# EAGLE board battery_module (EAGLE 9.1.1), part 1 of 2
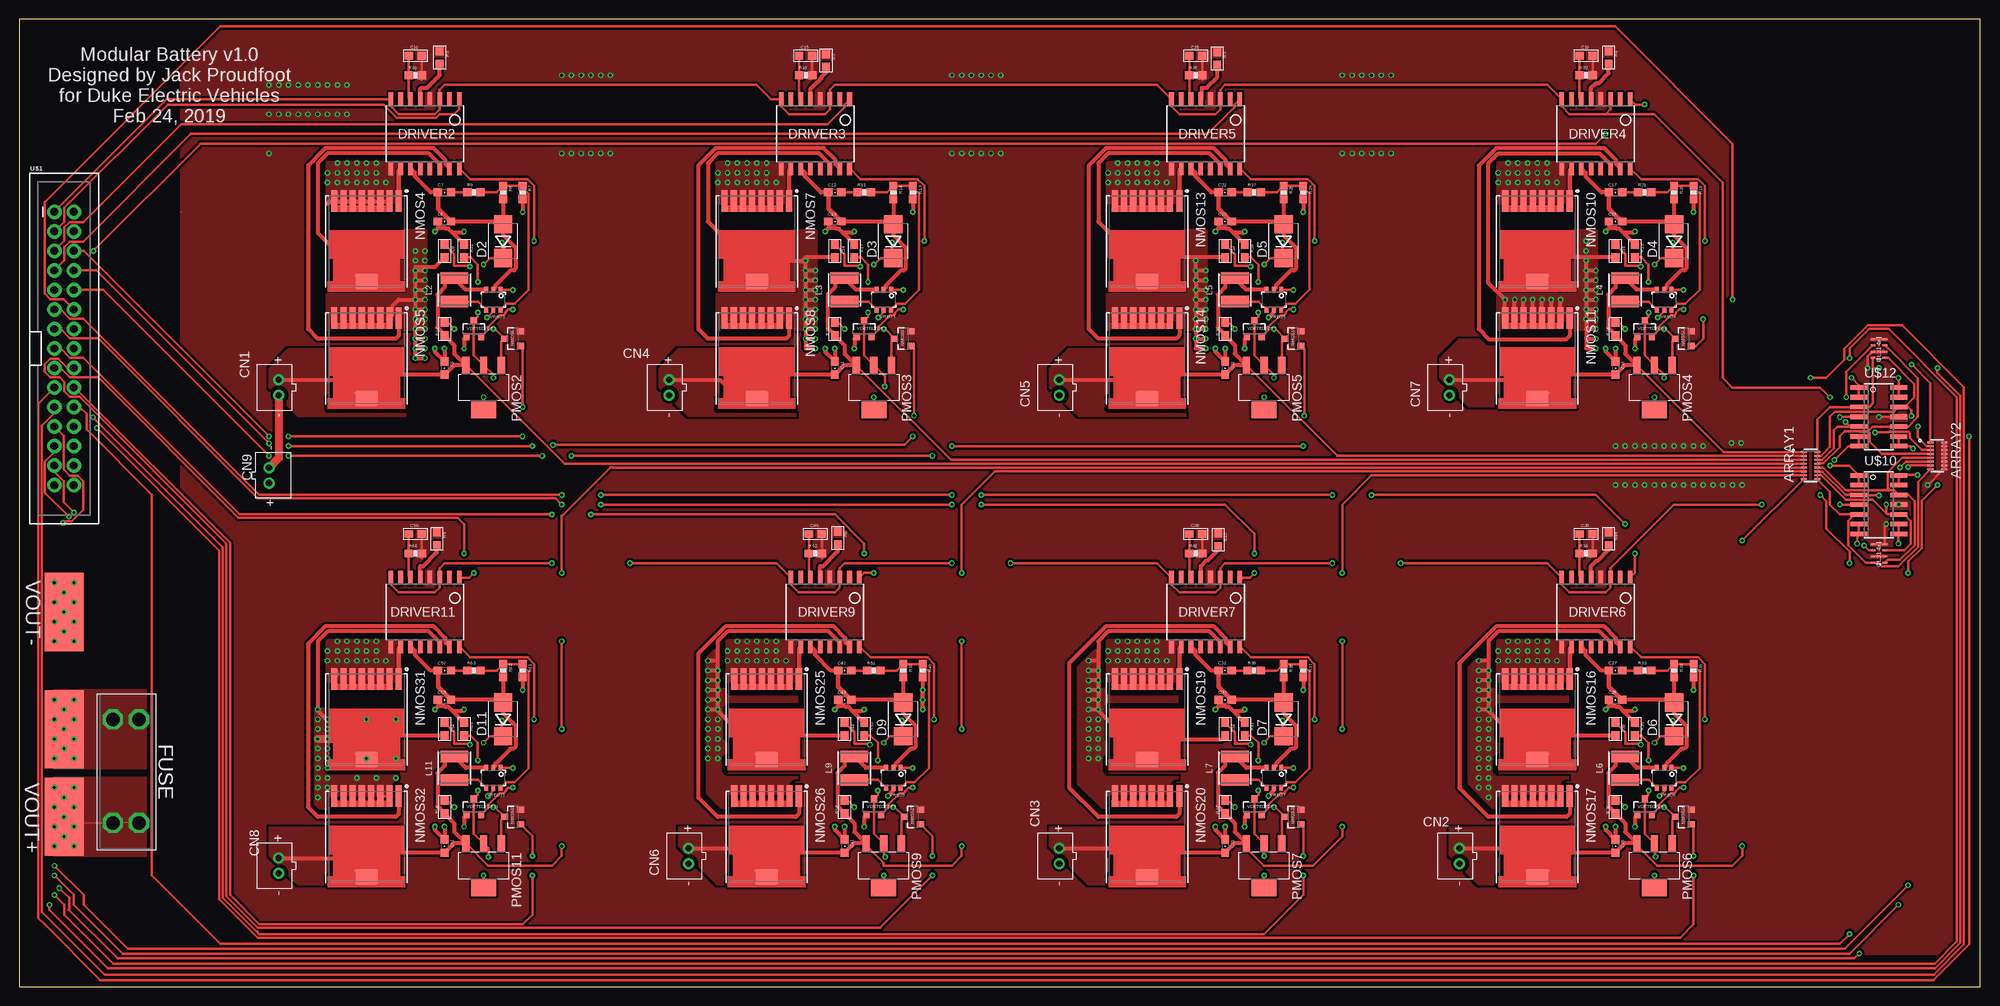
[diagram p2: board, top side]
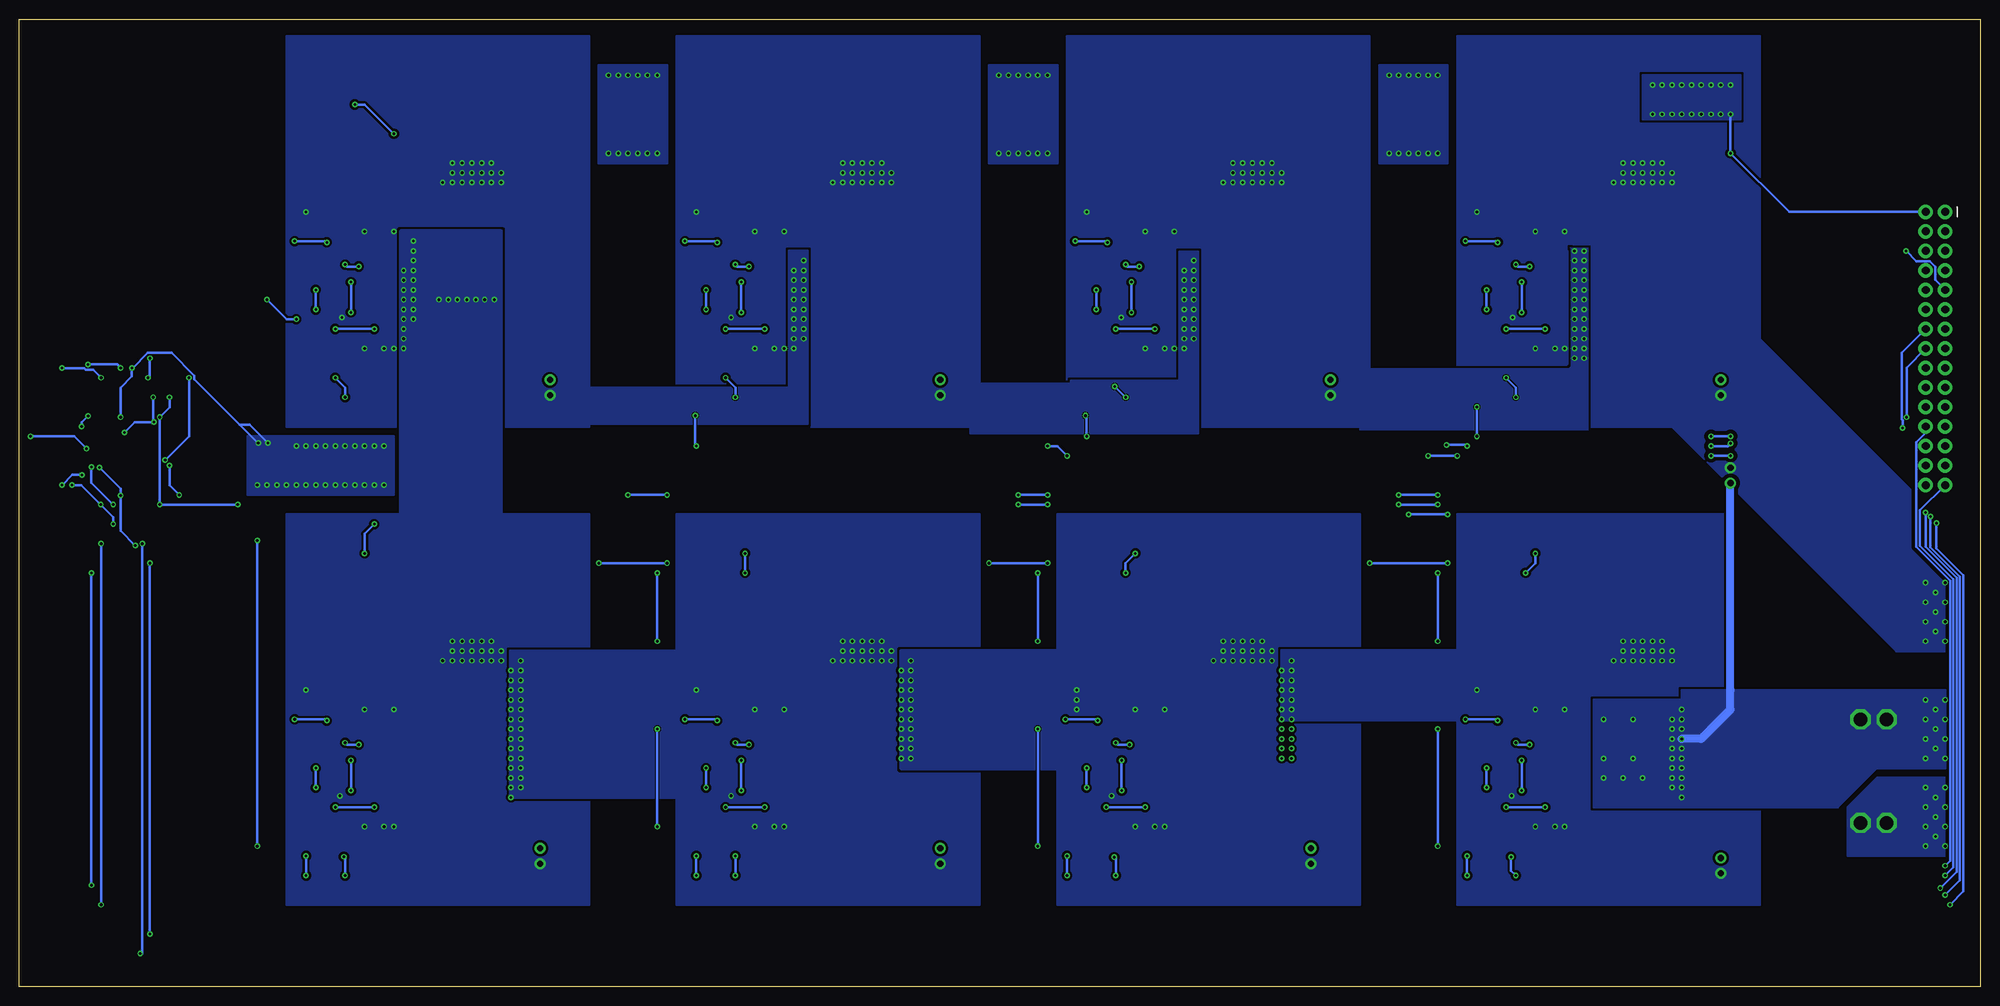
[diagram p3: board, bottom side, seen from below]

Size 255.27 x 125.91 mm. Coordinates in mm from the lower left corner, seen from the top.
Outline: 255.27,0 255.27,125.91 0,125.91 0,0 255.27,0
Copper layers (1*16): Top 0.0356mm / dielectric 1.5011mm / Bottom 0.0356mm
Design rules "jlcpcb_tented": minimum track width 5mil, minimum drill 13mil, track to track 5mil, track to pad 5mil, pad to pad 5mil, via to via 5mil, smd to smd 5mil, copper to edge 15mil, drill to drill 6mil, minimum pad ring 7mil, minimum via ring 7mil, stop-mask expansion 2.5mil, vias tented up to drill 0.35mm, thermal gap 10mil

## Footprints (pad centres in the part's own frame; a part is rotated, then mirrored left to right if it is on the bottom)
1506 = smd 0.84 x 0.34: 1 -0.895,1.75; 2 -0.895,1.25; 3 -0.895,0.75; 4 -0.895,0.25; 5 -0.895,-0.25; 6 -0.895,-0.75; 7 -0.895,-1.25; 8 -0.895,-1.75; 9 0.895,-1.75; 10 0.895,-1.25; 11 0.895,-0.75; 12 0.895,-0.25; 13 0.895,0.25; 14 0.895,0.75; 15 0.895,1.25; 16 0.895,1.75
0603-CAP = smd 1.1 x 1: 1 -0.85,0; 2 0.85,0
JST-PH-2-THM = drill 0.8 pad 1.422: 1 1,0; 2 -1,0
SMB-DIODE = smd 2.4 x 2.4: A 2.2,0; C -2.2,0
SOIC16LWB = smd 0.6 x 1.8: 1 -4.445,-4.475; 2 -3.175,-4.475; 3 -1.905,-4.475; 4 -0.635,-4.475; 5 0.635,-4.475; 6 1.905,-4.475; 7 3.175,-4.475; 8 4.445,-4.475; 9 4.445,4.475; 10 3.175,4.475; 11 1.905,4.475; 12 0.635,4.475; 13 -0.635,4.475; 14 -1.905,4.475; 15 -3.175,4.475; 16 -4.445,4.475
WE-LQS_4025 = smd 1.5 x 3.6: 1 -1.525,0; 2 1.525,0
INF-PG-HSOF-8-1-0 = smd 2.8 x 0.8: 1 -5.25,4.2; 2 -5.25,3; 3 -5.25,1.8; 4 -5.25,0.6; 5 -5.25,-0.6; 6 -5.25,-1.8; 7 -5.25,-3; 8 -5.25,-4.2 | smd 2 x 3: 9 5.25,0
SOT23-3 = smd 0.8 x 0.9: 1 -0.95,-1; 2 0.95,-1; 3 0,1.1
SOT223 = smd 0.95 x 2.15: 1 -2.3,-2.9; 2 0,-2.9; 3 2.3,-2.9 | smd 3.25 x 2.15: 4 0,2.9
0603-RES = smd 1.1 x 1: 1 -0.85,0; 2 0.85,0
2X15_SHROUDED = drill 1.016 pad 1.88: 1 -1.27,17.78; 2 1.27,17.78; 3 -1.27,15.24; 4 1.27,15.24; 5 -1.27,12.7; 6 1.27,12.7; 7 -1.27,10.16; 8 1.27,10.16; 9 -1.27,7.62; 10 1.27,7.62; 11 -1.27,5.08; 12 1.27,5.08; 13 -1.27,2.54; 14 1.27,2.54; 15 -1.27,0; 16 1.27,0; 17 -1.27,-2.54; 18 1.27,-2.54; 19 -1.27,-5.08; 20 1.27,-5.08; 21 -1.27,-7.62; 22 1.27,-7.62; 23 -1.27,-10.16; 24 1.27,-10.16; 25 -1.27,-12.7; 26 1.27,-12.7; 27 -1.27,-15.24; 28 1.27,-15.24; 29 -1.27,-17.78; 30 1.27,-17.78
AUTO_FUSE = drill 1.75 octagon: 1A 0,3.4; 1B 0,0; 2A 13.47,3.4; 2B 13.47,0
SOIC14 = smd 0.6 x 2.2: 1 -3.81,-2.6; 2 -2.54,-2.6; 3 -1.27,-2.6; 4 0,-2.6; 5 1.27,-2.6; 6 2.54,-2.6; 7 3.81,-2.6; 8 3.81,2.6; 9 2.54,2.6; 10 1.27,2.6; 11 0,2.6; 12 -1.27,2.6; 13 -2.54,2.6; 14 -3.81,2.6
1206-4XARRAY = smd 0.25 x 0.6: P$1 -1.2,0.775; P$2 -1.2,-0.775; P$3 -0.4,0.775; P$4 -0.4,-0.775; P$5 0.4,0.775; P$6 0.4,-0.775; P$7 1.2,0.775; P$8 1.2,-0.775
PAD = smd 10.16 x 5.08: PAD 0,0
SOT-23-6 = smd 0.51 x 0.8: 1 -0.95,-1.3; 2 0,-1.3; 3 0.95,-1.3; 4 0.95,1.3; 5 0,1.3; 6 -0.95,1.3

## Placement (x,y rotation side)
ARRAY1  47k  [1506]  233.17,67.82 0 top
ARRAY2  EXB-2HV  [1506]  249.68,69.09 0 top
C6  1uF  [0603-CAP]  55.37,80.52 270 top
C7  22pF  [0603-CAP]  55.37,103.38 0 top
C8  1uF  [0603-CAP]  55.37,99.57 0 top
C9  4.7uF  [0603-CAP]  55.37,95.76 270 top
C10  [0603-CAP]  51.56,121.16 0 top
C11  1uF  [0603-CAP]  106.17,80.52 270 top
C12  22pF  [0603-CAP]  106.17,103.38 0 top
C13  1uF  [0603-CAP]  106.17,99.57 0 top
C14  4.7uF  [0603-CAP]  106.17,95.76 270 top
C15  [0603-CAP]  102.36,121.16 0 top
C16  1uF  [0603-CAP]  207.77,80.52 270 top
C17  22pF  [0603-CAP]  207.77,103.38 0 top
C18  1uF  [0603-CAP]  207.77,99.57 0 top
C19  4.7uF  [0603-CAP]  207.77,95.76 270 top
C20  [0603-CAP]  203.96,121.16 0 top
C21  1uF  [0603-CAP]  156.97,80.52 270 top
C22  22pF  [0603-CAP]  156.97,103.38 0 top
C23  1uF  [0603-CAP]  156.97,99.57 0 top
C24  4.7uF  [0603-CAP]  156.97,95.76 270 top
C25  [0603-CAP]  153.16,121.16 0 top
C26  1uF  [0603-CAP]  207.77,18.29 270 top
C27  22pF  [0603-CAP]  207.77,41.15 0 top
C28  1uF  [0603-CAP]  207.77,37.34 0 top
C29  4.7uF  [0603-CAP]  207.77,33.53 270 top
C30  [0603-CAP]  203.96,58.93 0 top
C31  1uF  [0603-CAP]  156.97,18.29 270 top
C32  22pF  [0603-CAP]  156.97,41.15 0 top
C33  1uF  [0603-CAP]  156.97,37.34 0 top
C34  4.7uF  [0603-CAP]  156.97,33.53 270 top
C35  [0603-CAP]  153.16,58.93 0 top
C41  1uF  [0603-CAP]  107.44,18.29 270 top
C42  22pF  [0603-CAP]  107.44,41.15 0 top
C43  1uF  [0603-CAP]  107.44,37.34 0 top
C44  4.7uF  [0603-CAP]  107.44,33.53 270 top
C45  [0603-CAP]  103.63,58.93 0 top
C51  1uF  [0603-CAP]  55.37,18.29 270 top
C52  22pF  [0603-CAP]  55.37,41.15 0 top
C53  1uF  [0603-CAP]  55.37,37.34 0 top
C54  4.7uF  [0603-CAP]  55.37,33.53 270 top
C55  [0603-CAP]  51.56,58.93 0 top
CN1  [JST-PH-2-THM]  33.78,77.98 90 top
CN2  [JST-PH-2-THM]  187.45,17.02 90 top
CN3  [JST-PH-2-THM]  135.38,17.02 90 top
CN4  [JST-PH-2-THM]  84.58,77.98 90 top
CN5  [JST-PH-2-THM]  135.38,77.98 90 top
CN6  [JST-PH-2-THM]  87.12,17.02 90 top
CN7  [JST-PH-2-THM]  186.18,77.98 90 top
CN8  [JST-PH-2-THM]  33.78,15.75 90 top
CN9  [JST-PH-2-THM]  32.51,66.55 270 top
D2  [SMB-DIODE]  62.99,97.03 90 top
D3  [SMB-DIODE]  113.79,97.03 90 top
D4  [SMB-DIODE]  215.39,97.03 90 top
D5  [SMB-DIODE]  164.59,97.03 90 top
D6  [SMB-DIODE]  215.39,34.8 90 top
D7  [SMB-DIODE]  164.59,34.8 90 top
D9  [SMB-DIODE]  115.06,34.8 90 top
D11  [SMB-DIODE]  62.99,34.8 90 top
DRIVER2  SI8231SOIC16W  [SOIC16LWB]  52.83,111 180 top
DRIVER3  SI8231SOIC16W  [SOIC16LWB]  103.63,111 180 top
DRIVER4  SI8231SOIC16W  [SOIC16LWB]  205.23,111 180 top
DRIVER5  SI8231SOIC16W  [SOIC16LWB]  154.43,111 180 top
DRIVER6  SI8231SOIC16W  [SOIC16LWB]  205.23,48.77 180 top
DRIVER7  SI8231SOIC16W  [SOIC16LWB]  154.43,48.77 180 top
DRIVER9  SI8231SOIC16W  [SOIC16LWB]  104.9,48.77 180 top
DRIVER11  SI8231SOIC16W  [SOIC16LWB]  52.83,48.77 180 top
L2  [WE-LQS_4025]  56.64,90.68 90 top
L3  [WE-LQS_4025]  107.44,90.68 90 top
L4  [WE-LQS_4025]  209.04,90.68 90 top
L5  [WE-LQS_4025]  158.24,90.68 90 top
L6  [WE-LQS_4025]  209.04,28.45 90 top
L7  [WE-LQS_4025]  158.24,28.45 90 top
L9  [WE-LQS_4025]  108.71,28.45 90 top
L11  [WE-LQS_4025]  56.64,28.45 90 top
NMOS4  IPT004N03L  [INF-PG-HSOF-8-1-0]  45.21,97.03 270 top
NMOS5  IPT004N03L  [INF-PG-HSOF-8-1-0]  45.21,81.79 270 top
NMOS6  MOSFET-NCHANNELSMD  [SOT23-3]  64.26,84.33 90 top
NMOS7  IPT004N03L  [INF-PG-HSOF-8-1-0]  96.01,97.03 270 top
NMOS8  IPT004N03L  [INF-PG-HSOF-8-1-0]  96.01,81.79 270 top
NMOS9  MOSFET-NCHANNELSMD  [SOT23-3]  115.06,84.33 90 top
NMOS10  IPT004N03L  [INF-PG-HSOF-8-1-0]  197.61,97.03 270 top
NMOS11  IPT004N03L  [INF-PG-HSOF-8-1-0]  197.61,81.79 270 top
NMOS12  MOSFET-NCHANNELSMD  [SOT23-3]  216.66,84.33 90 top
NMOS13  IPT004N03L  [INF-PG-HSOF-8-1-0]  146.81,97.03 270 top
NMOS14  IPT004N03L  [INF-PG-HSOF-8-1-0]  146.81,81.79 270 top
NMOS15  MOSFET-NCHANNELSMD  [SOT23-3]  165.86,84.33 90 top
NMOS16  IPT004N03L  [INF-PG-HSOF-8-1-0]  197.61,34.8 270 top
NMOS17  IPT004N03L  [INF-PG-HSOF-8-1-0]  197.61,19.56 270 top
NMOS18  MOSFET-NCHANNELSMD  [SOT23-3]  216.66,22.1 90 top
NMOS19  IPT004N03L  [INF-PG-HSOF-8-1-0]  146.81,34.8 270 top
NMOS20  IPT004N03L  [INF-PG-HSOF-8-1-0]  146.81,19.56 270 top
NMOS21  MOSFET-NCHANNELSMD  [SOT23-3]  165.86,22.1 90 top
NMOS25  IPT004N03L  [INF-PG-HSOF-8-1-0]  97.28,34.8 270 top
NMOS26  IPT004N03L  [INF-PG-HSOF-8-1-0]  97.28,19.56 270 top
NMOS27  MOSFET-NCHANNELSMD  [SOT23-3]  116.33,22.1 90 top
NMOS31  IPT004N03L  [INF-PG-HSOF-8-1-0]  45.21,34.8 270 top
NMOS32  IPT004N03L  [INF-PG-HSOF-8-1-0]  45.21,19.56 270 top
NMOS33  MOSFET-NCHANNELSMD  [SOT23-3]  64.26,22.1 90 top
PMOS2  MOSFET-PCHANNELSOT223  [SOT223]  60.45,77.98 180 top
PMOS3  MOSFET-PCHANNELSOT223  [SOT223]  111.25,77.98 180 top
PMOS4  MOSFET-PCHANNELSOT223  [SOT223]  212.85,77.98 180 top
PMOS5  MOSFET-PCHANNELSOT223  [SOT223]  162.05,77.98 180 top
PMOS6  MOSFET-PCHANNELSOT223  [SOT223]  212.85,15.75 180 top
PMOS7  MOSFET-PCHANNELSOT223  [SOT223]  162.05,15.75 180 top
PMOS9  MOSFET-PCHANNELSOT223  [SOT223]  112.52,15.75 180 top
PMOS11  MOSFET-PCHANNELSOT223  [SOT223]  60.45,15.75 180 top
R1  47k  [0603-RES]  54.74,120.9 270 top
R2  47k  [0603-RES]  105.03,120.52 270 top
R3  47k  [0603-RES]  155.96,120.78 270 top
R4  47k  [0603-RES]  206.88,120.9 270 top
R5  47k  [0603-RES]  54.36,58.29 270 top
R6  47k  [0603-RES]  106.55,58.42 270 top
R7  10k  [0603-RES]  65.53,103.38 270 top
R8  110k  [0603-RES]  62.99,103.38 270 top
R9  2k  [0603-RES]  59.18,103.38 0 top
R10  1k  [0603-RES]  51.56,118.62 0 top
R11  47k  [0603-RES]  57.91,95.76 270 top
R12  47k  [0603-RES]  55.37,85.6 90 top
R13  10k  [0603-RES]  116.33,103.38 270 top
R14  110k  [0603-RES]  113.79,103.38 270 top
R15  2k  [0603-RES]  109.98,103.38 0 top
R16  1k  [0603-RES]  102.36,118.62 0 top
R17  47k  [0603-RES]  108.71,95.76 270 top
R18  47k  [0603-RES]  106.17,85.6 90 top
R19  10k  [0603-RES]  217.93,103.38 270 top
R20  110k  [0603-RES]  215.39,103.38 270 top
R21  2k  [0603-RES]  211.58,103.38 0 top
R22  1k  [0603-RES]  203.96,118.62 0 top
R23  47k  [0603-RES]  210.31,95.76 270 top
R24  47k  [0603-RES]  207.77,85.6 90 top
R25  10k  [0603-RES]  167.13,103.38 270 top
R26  110k  [0603-RES]  164.59,103.38 270 top
R27  2k  [0603-RES]  160.78,103.38 0 top
R28  1k  [0603-RES]  153.16,118.62 0 top
R29  47k  [0603-RES]  159.51,95.76 270 top
R30  47k  [0603-RES]  156.97,85.6 90 top
R31  10k  [0603-RES]  217.93,41.15 270 top
R32  110k  [0603-RES]  215.39,41.15 270 top
R33  2k  [0603-RES]  211.58,41.15 0 top
R34  1k  [0603-RES]  203.96,56.39 0 top
R35  47k  [0603-RES]  210.31,33.53 270 top
R36  47k  [0603-RES]  207.77,23.37 90 top
R37  10k  [0603-RES]  167.13,41.15 270 top
R38  110k  [0603-RES]  164.59,41.15 270 top
R39  2k  [0603-RES]  160.78,41.15 0 top
R40  1k  [0603-RES]  153.16,56.39 0 top
R41  47k  [0603-RES]  159.51,33.53 270 top
R42  47k  [0603-RES]  156.97,23.37 90 top
R43  47k  [0603-RES]  156.08,58.17 270 top
R44  47k  [0603-RES]  206.88,58.29 270 top
R49  10k  [0603-RES]  117.6,41.15 270 top
R50  110k  [0603-RES]  115.06,41.15 270 top
R51  2k  [0603-RES]  111.25,41.15 0 top
R52  1k  [0603-RES]  103.63,56.39 0 top
R53  47k  [0603-RES]  109.98,33.53 270 top
R54  47k  [0603-RES]  107.44,23.37 90 top
R61  10k  [0603-RES]  65.53,41.15 270 top
R62  110k  [0603-RES]  62.99,41.15 270 top
R63  2k  [0603-RES]  59.18,41.15 0 top
R64  1k  [0603-RES]  51.56,56.39 0 top
R65  47k  [0603-RES]  57.91,33.53 270 top
R66  47k  [0603-RES]  55.37,23.37 90 top
U$1  30_HEADER  [2X15_SHROUDED]  5.84,83.06 0 top
U$2  FUSE  [AUTO_FUSE]  12.19,34.8 270 top
U$3  [DEV]  233.68,30.48 0 top
U$10  LM324  [SOIC14]  242.06,62.74 270 top
U$11  CL31  [1206-4XARRAY]  242.06,83.06 270 top
U$12  LM324  [SOIC14]  242.06,74.17 270 top
U$13  CL31  [1206-4XARRAY]  242.06,56.39 270 top
VDETECTOR2  BD49XXK__G  [SOT23-3]  59.18,85.6 0 top
VDETECTOR3  BD49XXK__G  [SOT23-3]  109.98,85.6 0 top
VDETECTOR4  BD49XXK__G  [SOT23-3]  211.58,85.6 0 top
VDETECTOR5  BD49XXK__G  [SOT23-3]  160.78,85.6 0 top
VDETECTOR6  BD49XXK__G  [SOT23-3]  211.58,23.37 0 top
VDETECTOR7  BD49XXK__G  [SOT23-3]  160.78,23.37 0 top
VDETECTOR9  BD49XXK__G  [SOT23-3]  111.25,23.37 0 top
VDETECTOR11  BD49XXK__G  [SOT23-3]  59.18,23.37 0 top
VOUT+  PAD  [PAD]  5.84,33.53 90 top
VOUT-  PAD  [PAD]  5.84,48.77 90 top
VOUT_FUSED  PAD  [PAD]  5.84,22.1 90 top
VREG2  R1200SOT-23-6  [SOT-23-6]  61.72,89.41 180 top
VREG3  R1200SOT-23-6  [SOT-23-6]  112.52,89.41 180 top
VREG4  R1200SOT-23-6  [SOT-23-6]  214.12,89.41 180 top
VREG5  R1200SOT-23-6  [SOT-23-6]  163.32,89.41 180 top
VREG6  R1200SOT-23-6  [SOT-23-6]  214.12,27.18 180 top
VREG7  R1200SOT-23-6  [SOT-23-6]  163.32,27.18 180 top
VREG9  R1200SOT-23-6  [SOT-23-6]  113.79,27.18 180 top
VREG11  R1200SOT-23-6  [SOT-23-6]  61.72,27.18 180 top